# EAGLE schematic qstp_q2 (EAGLE 9.6.2)
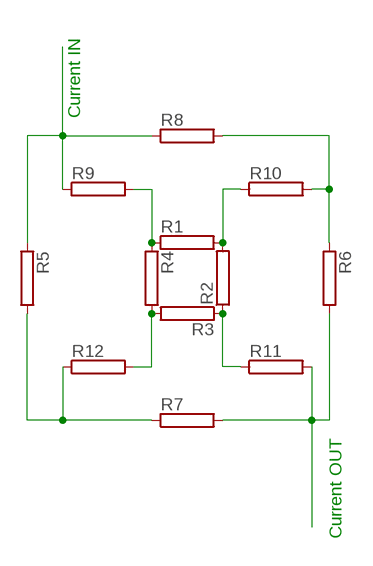
[diagram p0: schematic, sheet 1]

## Parts
R1  RAC01  [AC01]
R2  RAC01  [AC01]
R3  RAC01  [AC01]
R4  RAC01  [AC01]
R5  RAC01  [AC01]
R6  RAC01  [AC01]
R7  RAC01  [AC01]
R8  RAC01  [AC01]
R9  RAC01  [AC01]
R10  RAC01  [AC01]
R11  RAC01  [AC01]
R12  RAC01  [AC01]

## Nets
N$1: R1.2 R2.2 R10.1
N$2: R2.1 R3.1 R11.1
N$3: R1.1 R4.1 R9.2
N$4: R3.2 R4.2 R12.2
N$6: R6.2 R7.2 R11.2
N$7: R5.2 R7.1 R12.1
N$8: R5.1 R8.1 R9.1
N$9: R6.1 R8.2 R10.2

## Notes on the sheet
- Current IN
- Current OUT

## Library data of the parts
R1-R12 = resistor-power:R: Power Resitor; OC_FARNELL: unknown; OC_NEWARK: unknown